# EAGLE schematic Sch (EAGLE 7.5.0)
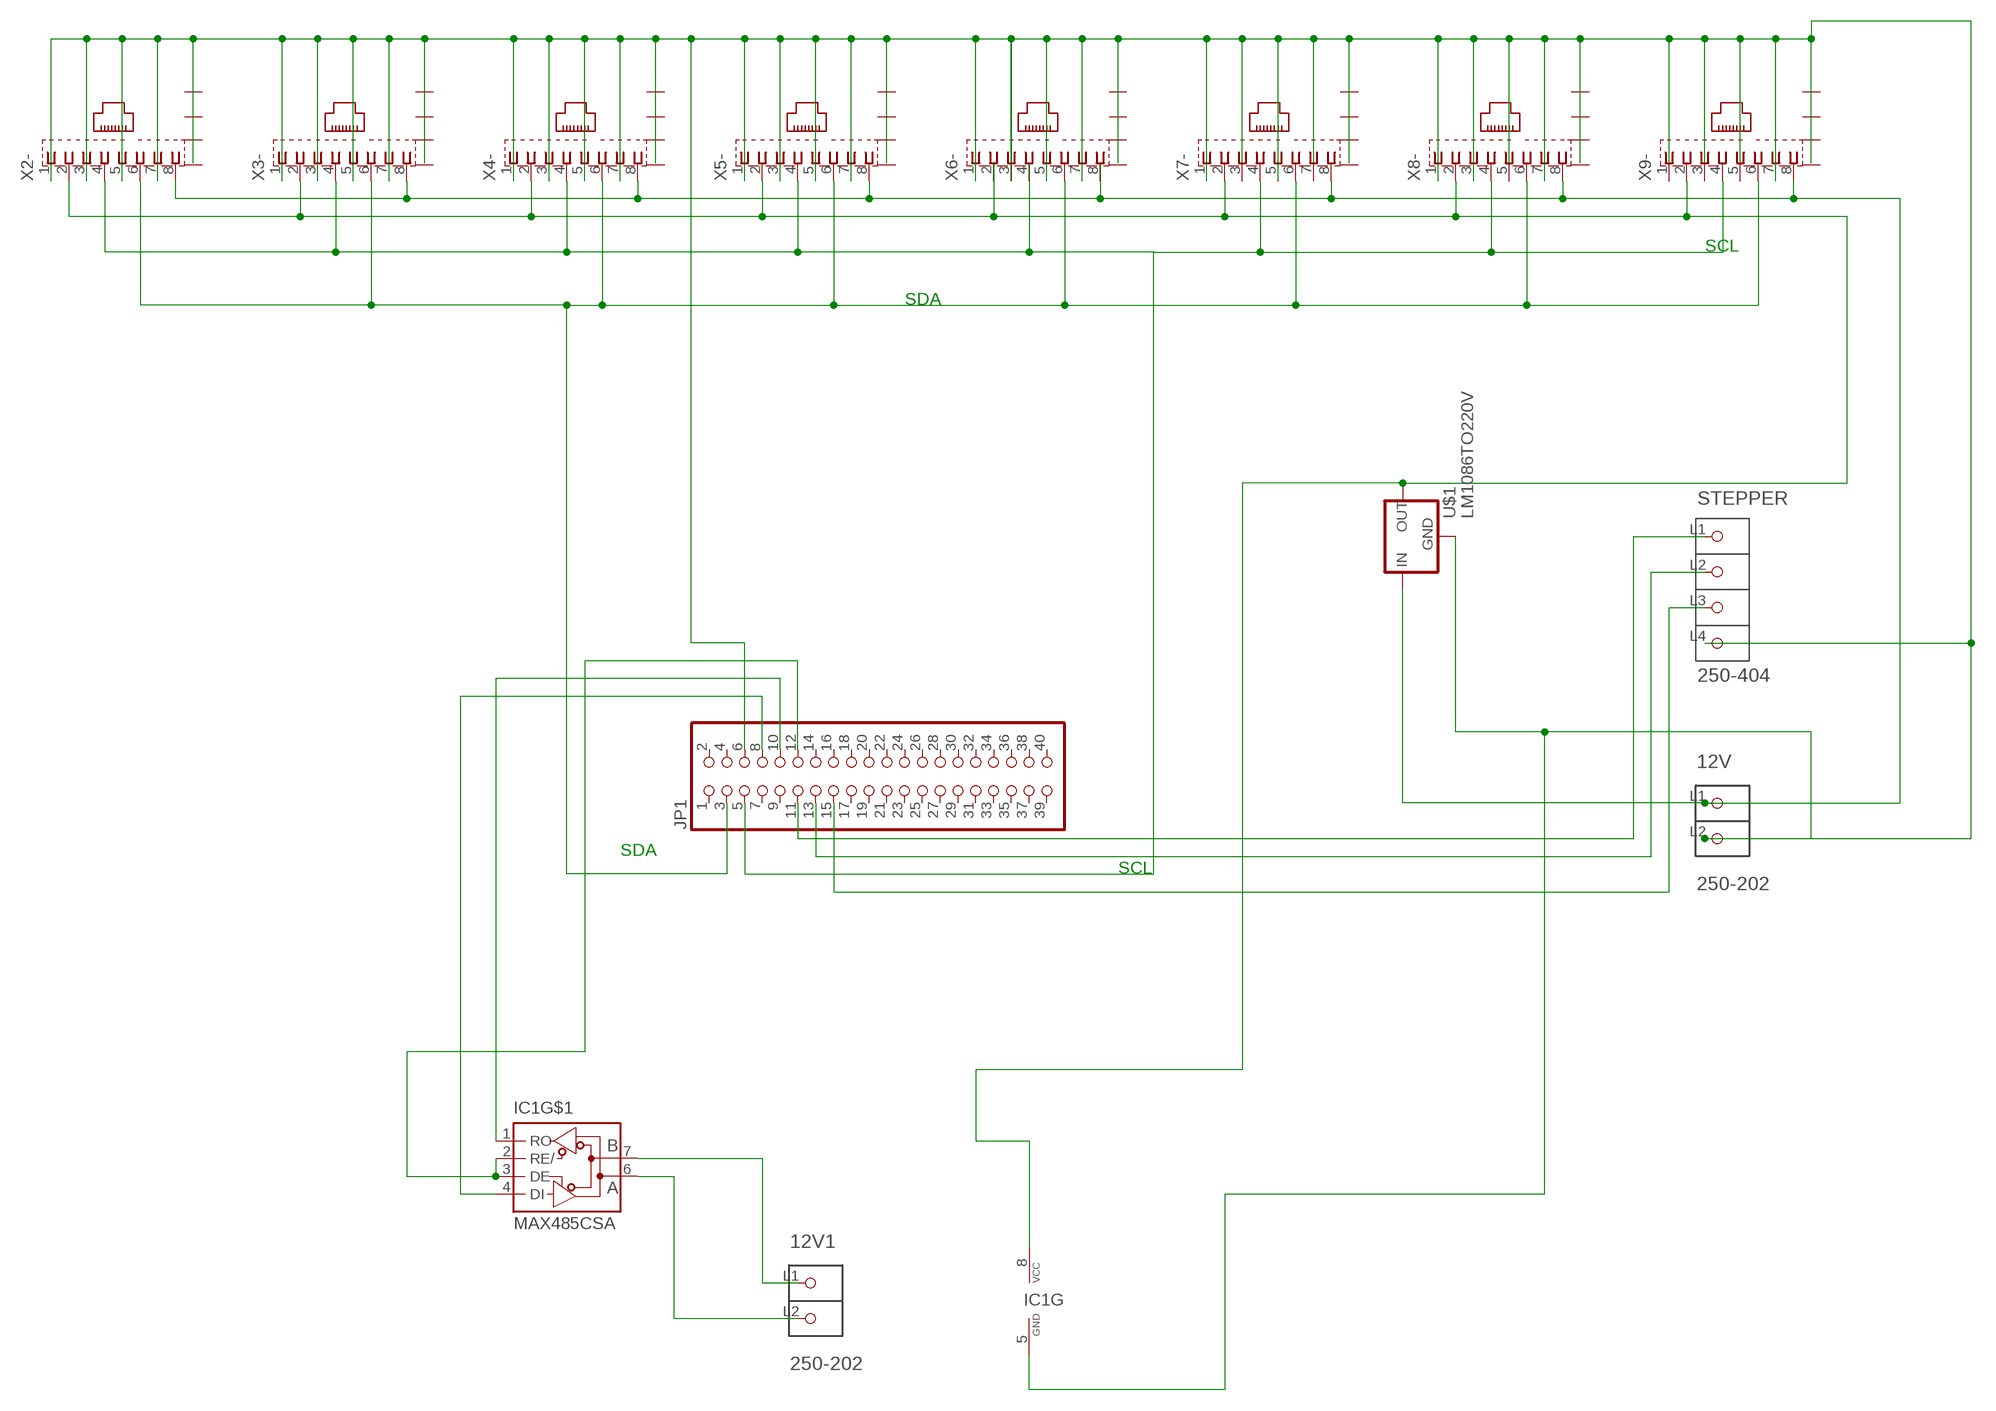
[diagram p0: schematic, sheet 1]

## Parts
12V  250-202  [P-250-202]
12V1  250-202  [P-250-202]
IC1  MAX485CSA  [SO08]
JP1  PINHD-2X20_2.54  [2X20]
STEPPER  250-404  [P-250-404]
U$1  LM1086TO220V  [TO220S]
X2  RJ45  [RJ45]
X3  RJ45  [RJ45]
X4  RJ45  [RJ45]
X5  RJ45  [RJ45]
X6  RJ45  [RJ45]
X7  RJ45  [RJ45]
X8  RJ45  [RJ45]
X9  RJ45  [RJ45]

## Nets
N$1: 12V.L2(P2) IC1.5(G:GND) JP1.6 STEPPER.L4(P4) U$1.1(GND) X2.1 X2.3 X2.5 X2.7 X3.1 X3.3 X3.5 X3.7 X4.1 X4.3 X4.5 X4.7 X5.1 X5.3 X5.5 X5.7 X6.1 X6.3 X6.5 X6.7 X7.1 X8.1 X8.3 X8.7 X9.7
N$2: JP1.3 X2.6 X3.6 X4.6 X5.6 X6.6 X7.6 X8.6 X9.6
N$3: JP1.5 X2.4 X3.4 X4.4 X5.4 X6.4 X7.4 X8.4 X9.4
N$4: 12V.L1(P1) U$1.3(IN) X2.8 X3.8 X4.8 X5.8 X6.8 X7.8 X8.8 X9.8
N$5: JP1.15 STEPPER.L3(P3)
N$6: JP1.11 STEPPER.L1(P1)
N$7: JP1.13 STEPPER.L2(P2)
N$8: IC1.8(G:VCC) U$1.2(OUT) X2.2 X3.2 X4.2 X5.2 X6.2 X7.2 X8.2 X9.2
N$9: IC1.2(RE/) IC1.3(DE) JP1.12
N$10: IC1.1(RO) JP1.10
N$11: IC1.4(DI) JP1.8
N$12: 12V1.L2(P2) IC1.6(A)
N$13: 12V1.L1(P1) IC1.7(B)
Unconnected: JP1.1 JP1.2 JP1.4 JP1.7 JP1.9 JP1.14 JP1.16 JP1.17 JP1.18 JP1.19 JP1.20 JP1.21 JP1.22 JP1.23 JP1.24 JP1.25 JP1.26 JP1.27 JP1.28 JP1.29 JP1.30 JP1.31 JP1.32 JP1.33 JP1.34 JP1.35 JP1.36 JP1.37 JP1.38 JP1.39 JP1.40 X2.G1 X2.G2 X2.G3 X2.G4 X3.G1 X3.G2 X3.G3 X3.G4 X4.G1 X4.G2 X4.G3 X4.G4 X5.G1 X5.G2 X5.G3 X5.G4 X6.G1 X6.G2 X6.G3 X6.G4 X7.3 X7.5 X7.7 X7.G1 X7.G2 X7.G3 X7.G4 X8.5 X8.G1 X8.G2 X8.G3 X8.G4 X9.1 X9.3 X9.5 X9.G1 X9.G2 X9.G3 X9.G4

## Notes on the sheet
- SCL
- SDA
- SDA
- SCL

## Library data of the parts
12V 12V1 = con-wago_250:250-202: Serie 250, 1-Leiter-Klemmenleiste für Leiterplatten 1 Lötstift/Pol versetzt / Series 250, 1-conductor PCB terminal strip 1 solder pin/pole, staggered Polzahl / Pole No.: 2 Rastermaß / Pitch: 3.5 - 3.5 mm Bemessungsspannung / Rated Voltage: 320 V Nennstrom / Nominal Current: 8 A Leiterquerschnitt / Conductor Size: 0.2 - 1.5 mm2 Anschlusstechnik / Connection Technology: CAGE CLAMP® S Lötstiftlänge: / Solder Pin Length: 3.6 mm Leitereinführung (zur Platine) / Conductor entry angle (to PCB): 45 ° Farbe / Color: grau / gray Stand: 01.01.2014. Die jeweils aktuellen Daten zu diesem Artikel finden Sie in unserem Produktkatalog, den Sie unter www.wago.com einsehen können. As of: 01/01/2014. Please find the newest data for this article in our product catalogue, which can be viewed under www.wago.com.
IC1 = andereBauteile:MAX485: MAX485 RS485 Half Duplex Driver
JP1 = pinhead-1:PINHD-2X20: PIN HEADER
STEPPER = con-wago_250:250-404: Serie 250, 1-Leiter-Klemmenleiste für Leiterplatten 1 Lötstift/Pol versetzt / Series 250, 1-conductor PCB terminal strip 1 solder pin/pole, staggered Polzahl / Pole No.: 4 Rastermaß / Pitch: 2.5 - 2.5 mm Bemessungsspannung / Rated Voltage: 160 V Nennstrom / Nominal Current: 4 A Leiterquerschnitt / Conductor Size: 0.14 - 0.5 mm2 Anschlusstechnik / Connection Technology: CAGE CLAMP® S Lötstiftlänge: / Solder Pin Length: 3.6 mm Leitereinführung (zur Platine) / Conductor entry angle (to PCB): 45 ° Farbe / Color: grau / gray Stand: 01.01.2014. Die jeweils aktuellen Daten zu diesem Artikel finden Sie in unserem Produktkatalog, den Sie unter www.wago.com einsehen können. As of: 01/01/2014. Please find the newest data for this article in our product catalogue, which can be viewed under www.wago.com.
U$1 = v-reg-2:LM1086
X2-X9 = con-appsys:RJ45: AMP connector